# EAGLE design SpheroRemote_Version2 (EAGLE 9.0.1)
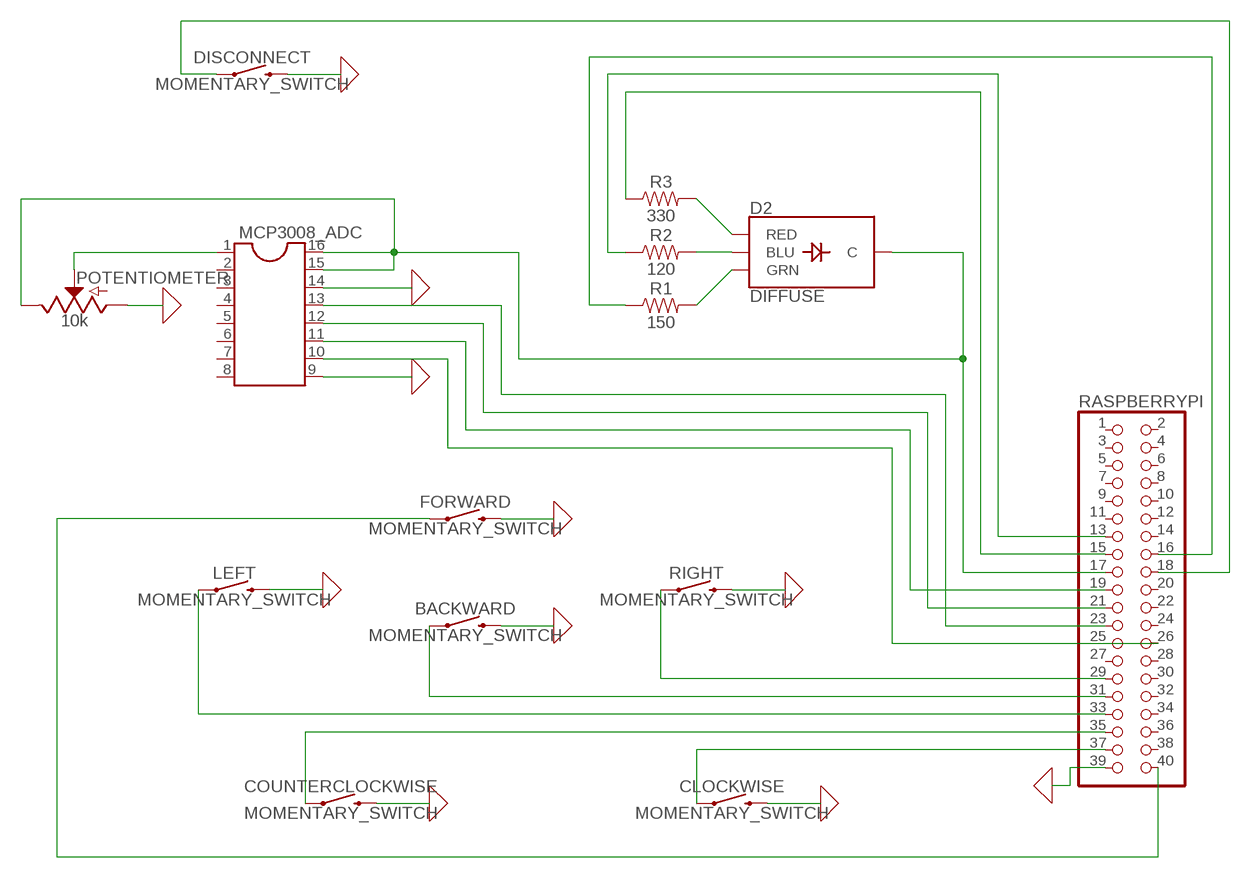
[diagram p0: schematic, sheet 1]

## Parts
BACKWARD  MOMENTARY_SWITCH  MOMENTARY-SWITCH-SPST-PTH-12MM  [TACTILE_SWITCH_PTH_12MM]
CLOCKWISE  MOMENTARY_SWITCH  MOMENTARY-SWITCH-SPST-PTH-12MM  [TACTILE_SWITCH_PTH_12MM]
COUNTERCLOCKWISE  MOMENTARY_SWITCH  MOMENTARY-SWITCH-SPST-PTH-12MM  [TACTILE_SWITCH_PTH_12MM]
D2  DIFFUSE  LED-RGB-CCDIFFUSE  [LED-RGB-THRU]
DISCONNECT  MOMENTARY_SWITCH  MOMENTARY-SWITCH-SPST-PTH-12MM  [TACTILE_SWITCH_PTH_12MM]
FORWARD  MOMENTARY_SWITCH  MOMENTARY-SWITCH-SPST-PTH-12MM  [TACTILE_SWITCH_PTH_12MM]
LEFT  MOMENTARY_SWITCH  MOMENTARY-SWITCH-SPST-PTH-12MM  [TACTILE_SWITCH_PTH_12MM]
MCP3008_ADC  DIL16  [DIL16]
POTENTIOMETER  10k  POTENTIOMETER-PTH-9MM-1/20W-20%-KIT  [POT-PTH-ALPS-KIT]
R1  150  330OHM-HORIZ-1/10W-5%  [AXIAL-0.3]
R2  120  330OHM-HORIZ-1/10W-5%  [AXIAL-0.3]
R3  330  330OHM-HORIZ-1/10W-5%  [AXIAL-0.3]
RASPBERRYPI  PINHD-2X20  [2X20]
RIGHT  MOMENTARY_SWITCH  MOMENTARY-SWITCH-SPST-PTH-12MM  [TACTILE_SWITCH_PTH_12MM]

## Nets
0: BACKWARD.3 CLOCKWISE.3 COUNTERCLOCKWISE.3 DISCONNECT.3 FORWARD.3 LEFT.3 MCP3008_ADC.9 MCP3008_ADC.14 POTENTIOMETER.P$3(A) RASPBERRYPI.39 RIGHT.3 ; supply symbol labelled GND
N$1: D2.3(GRN) R1.P$2
N$2: R3.P$1 RASPBERRYPI.15
N$3: D2.4(BLU) R2.P$2
N$4: MCP3008_ADC.1 POTENTIOMETER.P$2(S)
N$5: LEFT.1 RASPBERRYPI.33
N$6: BACKWARD.1 RASPBERRYPI.31
N$7: RASPBERRYPI.29 RIGHT.1
N$8: CLOCKWISE.1 RASPBERRYPI.37
N$9: COUNTERCLOCKWISE.1 RASPBERRYPI.35
N$10: D2.1(RED) R3.P$2
N$12: MCP3008_ADC.13 RASPBERRYPI.23
N$13: R2.P$1 RASPBERRYPI.13
N$14: MCP3008_ADC.12 RASPBERRYPI.21
N$15: MCP3008_ADC.11 RASPBERRYPI.19
N$16: D2.2(C) MCP3008_ADC.15 MCP3008_ADC.16 POTENTIOMETER.P$1(E) RASPBERRYPI.17
N$17: MCP3008_ADC.10 RASPBERRYPI.26
N$18: DISCONNECT.1 RASPBERRYPI.18
N$19: FORWARD.1 RASPBERRYPI.40
N$20: R1.P$1 RASPBERRYPI.16
Unconnected: MCP3008_ADC.2 MCP3008_ADC.3 MCP3008_ADC.4 MCP3008_ADC.5 MCP3008_ADC.6 MCP3008_ADC.7 MCP3008_ADC.8 RASPBERRYPI.1 RASPBERRYPI.2 RASPBERRYPI.3 RASPBERRYPI.4 RASPBERRYPI.5 RASPBERRYPI.6 RASPBERRYPI.7 RASPBERRYPI.8 RASPBERRYPI.9 RASPBERRYPI.10 RASPBERRYPI.11 RASPBERRYPI.12 RASPBERRYPI.14 RASPBERRYPI.20 RASPBERRYPI.22 RASPBERRYPI.24 RASPBERRYPI.25 RASPBERRYPI.27 RASPBERRYPI.28 RASPBERRYPI.30 RASPBERRYPI.32 RASPBERRYPI.34 RASPBERRYPI.36 RASPBERRYPI.38

## Library data of the parts
BACKWARD CLOCKWISE COUNTERCLOCKWISE DISCONNECT FORWARD LEFT RIGHT = SparkFun-Switches:MOMENTARY-SWITCH-SPST: Momentary Switch (Pushbutton) - SPST Normally-open (NO) SPST momentary switches (buttons, pushbuttons). Variants PTH-12MM - 12mm square, through-hole Momentary Pushbutton Switch - 12mm Square <https://www.sparkfun.com/products/9190> (COM-09190) PTH-6.0MM, PTH-6.0MM-KIT - 6.0mm square, through-hole Mini Pushbutton Switch <https://www.sparkfun.com/products/97> (COM-00097) KIT package intended for soldering kit's - only one side of pads' copper is exposed. PTH-RIGHT-ANGLE-KIT - Right-angle, through-hole Right Angle Tactile Button <https://www.sparkfun.com/products/10791> - Used on SparkFun BigTime Watch Kit <https://www.sparkfun.com/products/11734> SMD-12MM - 12mm square, surface-mount Tactile Button - SMD (12mm) <https://www.sparkfun.com/products/12993> (COM-12993) Used on SparkFun PicoBoard <https://www.sparkfun.com/products/11888> SMD-4.5MM - 4.5mm Square Trackball Switch Used on SparkFun Blackberry Trackballer Breakout <https://www.sparkfun.com/products/13169> SMD-4.6MMX2.8MM - 4.60mm x 2.80mm, surface mount Used on SparkFun SAMD21 Mini Breakout <https://www.sparkfun.com/products/13664> SMD-5.2MM, SMD-5.2-REDUNDANT - 5.2mm square, surface-mount Mini Pushbutton Switch - SMD <https://www.sparkfun.com/products/8720> (COM-08720) Used on Arduino Pro Mini <https://www.sparkfun.com/products/11114> REDUNDANT package connects both switch circuits together SMD-6.0X3.5MM - 6.0 x 3.5mm, surface mount Momentary Reset Switch SMD <https://www.sparkfun.com/products/8229> (COM-08229) SMD-6.2MM-TALL - 6.2mm square, surface mount Tactile Button - SMD (6mm) <https://www.sparkfun.com/products/12992> Used on SparkFun Digital Sandbox <https://www.sparkfun.com/products/12651> SMD-RIGHT-ANGLE - Right-angle, surface mount Used on SparkFun Block for Intel® Edison - Arduino <https://www.sparkfun.com/products/13036>; PROD_ID: SWCH-09185; SF_SKU: COM-09190
D2 = LED:LED-RGB-CC: LED-RGB Common Cathode Packages: LED RGB-THRU LED_PIRANHA_5MM SparkFun Products: RGB Diffused Common Cathode- Diffuse <[https://www.sparkfun.com/products/9264]> RGB Diffused Common Cathode - Clear <[https://www.sparkfun.com/products/105]> LED-RGB 5mm Square (Piranha) <[https://www.sparkfun.com/products/11679]>; PROD_ID: DIO-09434
MCP3008_ADC = ic-package:DIL16: Dual In Line / Socket; SPICEPREFIX: X
POTENTIOMETER = SparkFun-Resistors:POTENTIOMETER: Potentiometer (Pot) Three-terminal potentiometers, with an adjustable wiper and two adjustable resistors. A pot can be used to create a configurable voltage divider, or as a variable resistor. Variants ALPS_POT and ALPS_POT_KIT - PTH, breadboard compatible, 9mm square pots Rotary Potentiometer - Linear (10k ohm) <https://www.sparkfun.com/products/9288> (COM-09288) The KIT variant exposes copper on only one side of the PTH pad, so the part can only be assembled on one side of the PCB. Useful for beginner soldering kits.; PROD_ID: RES-09177; SF_SKU: COM-09288
R1 R2 = SparkFun-Resistors:330OHM: 330Ω resistor A resistor is a passive two-terminal electrical component that implements electrical resistance as a circuit element. Resistors act to reduce current flow, and, at the same time, act to lower voltage levels within circuits. - Wikipedia; PROD_ID: RES-8371; VALUE: 330
R3 = SparkFun-Resistors:330OHM: 330Ω resistor A resistor is a passive two-terminal electrical component that implements electrical resistance as a circuit element. Resistors act to reduce current flow, and, at the same time, act to lower voltage levels within circuits. - Wikipedia; PROD_ID: RES-8371
RASPBERRYPI = adafruit:PINHD-2X20: PIN HEADER

## Board
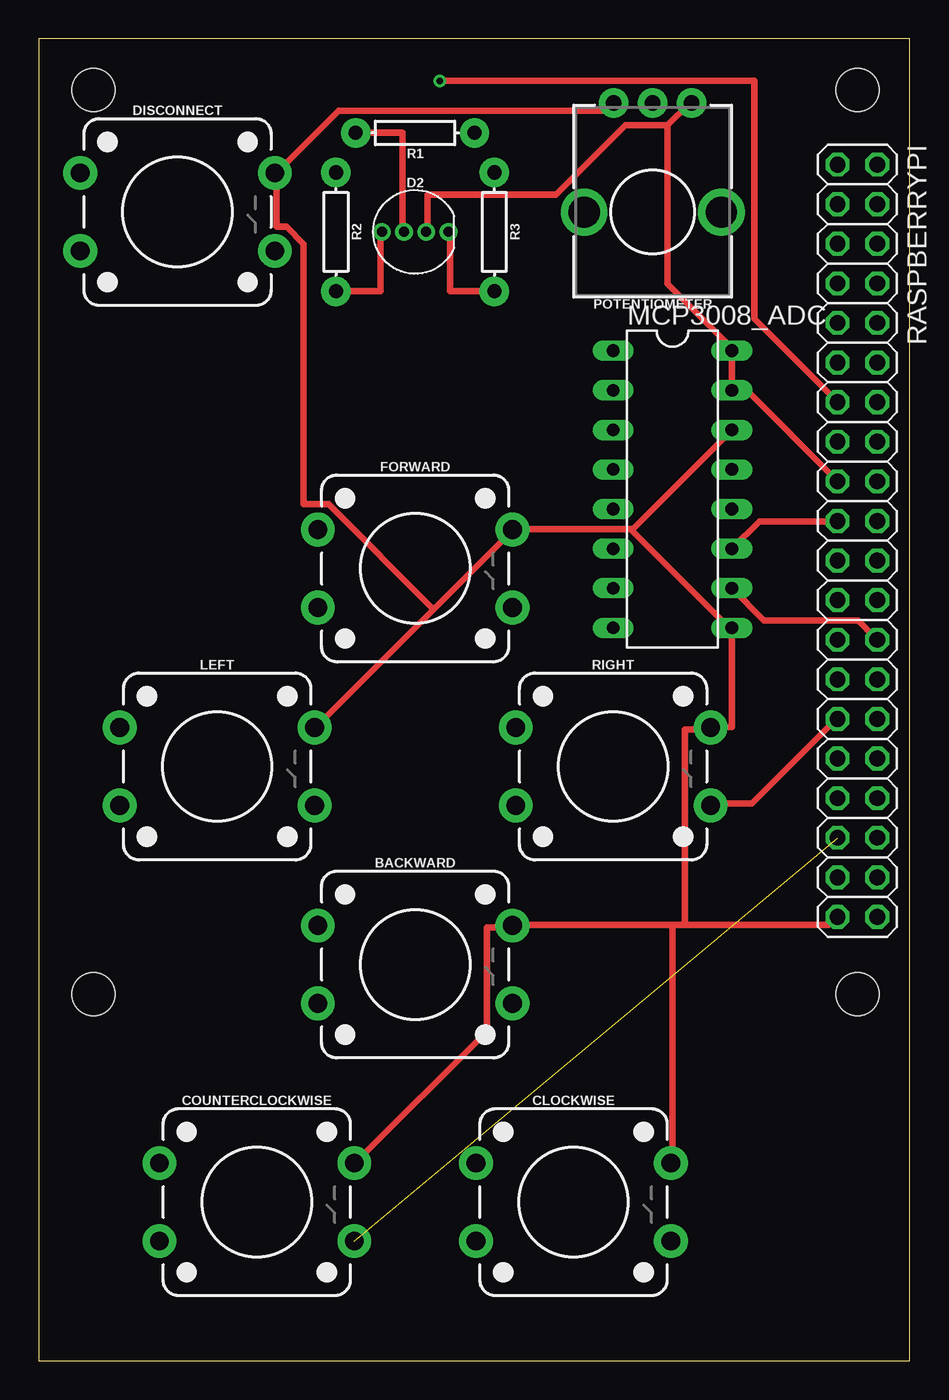
[diagram p1: board, top side]
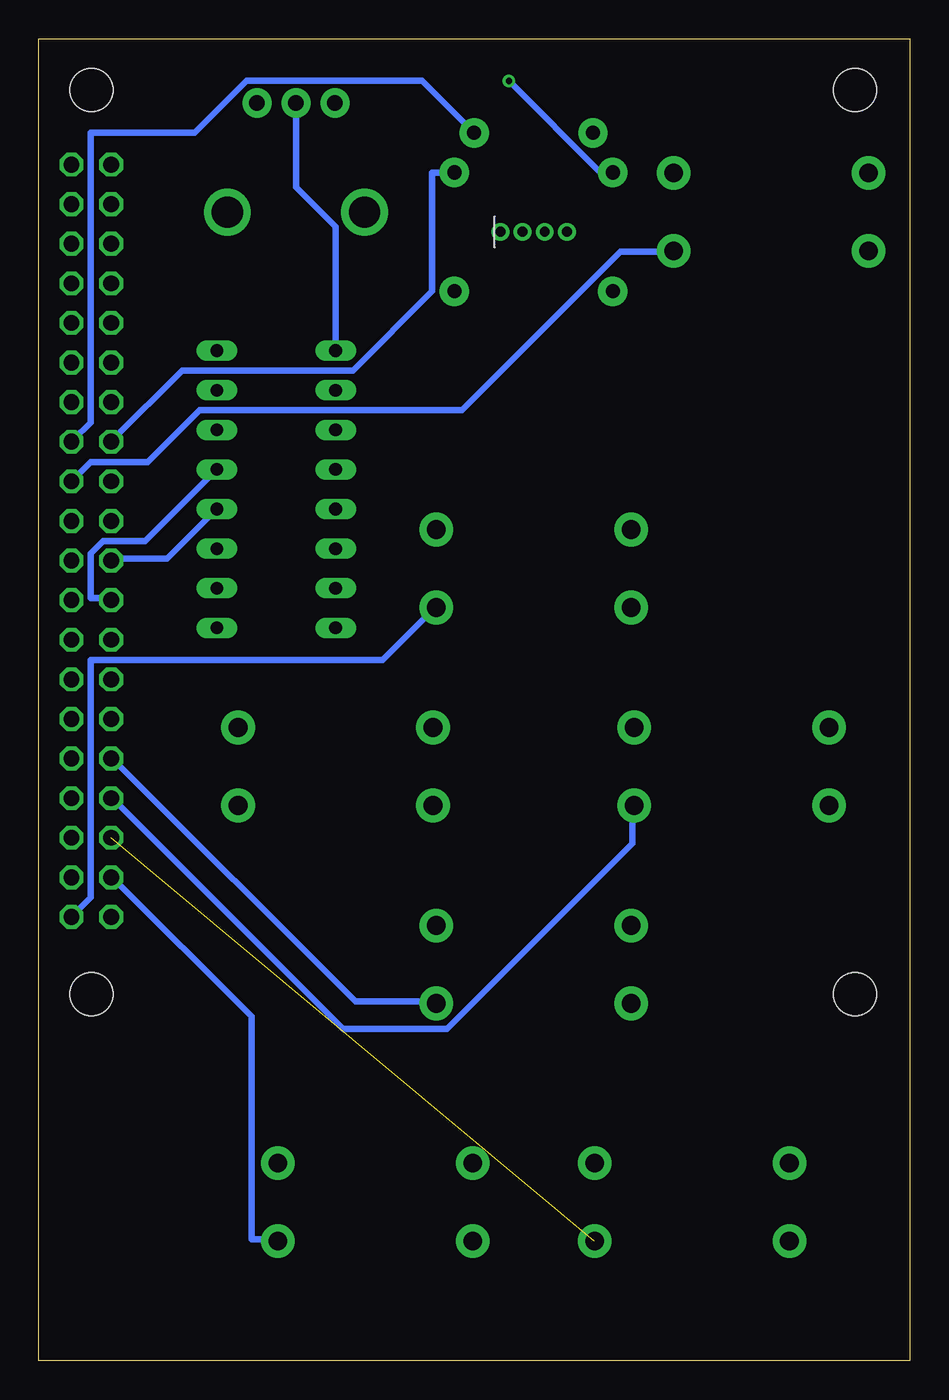
[diagram p2: board, bottom side, seen from below]

Size 55.86 x 84.76 mm. Coordinates in mm from the lower left corner, seen from the top.
Outline: 0,0 55.86,0 55.86,84.76 0,84.76 0,0
Copper layers (1*16): Top 0.035mm / dielectric 1.5mm / Bottom 0.035mm
Design rules "default *": minimum track width 16mil, minimum drill 0.4mm, track to track 12mil, track to pad 10mil, pad to pad 12mil, via to via 12mil, smd to smd 6mil, copper to edge 40mil, drill to drill 6mil, minimum pad ring 10mil, minimum via ring 8mil, stop-mask expansion 4mil, vias tented up to drill 0mil, thermal gap 10mil
Holes 2.74 mm at 52.5,81.48 3.51,81.48 3.51,23.5 52.5,23.5

### Footprints (pad centres in the part's own frame; a part is rotated, then mirrored left to right if it is on the bottom)
TACTILE_SWITCH_PTH_12MM = drill 1.2 pad 2.159: 1 6.25,-2.5; 2 -6.25,-2.5; 3 6.25,2.5; 4 -6.25,2.5
LED-RGB-THRU = drill 0.635 pad 0.711: 1 2.134,0; 2 0.711,0; 3 -0.711,0; 4 -2.134,0
DIL16 = drill 0.813 long: 1 -8.89,-3.81; 2 -6.35,-3.81; 3 -3.81,-3.81; 4 -1.27,-3.81; 5 1.27,-3.81; 6 3.81,-3.81; 7 6.35,-3.81; 8 8.89,-3.81; 9 8.89,3.81; 10 6.35,3.81; 11 3.81,3.81; 12 1.27,3.81; 13 -1.27,3.81; 14 -3.81,3.81; 15 -6.35,3.81; 16 -8.89,3.81
POT-PTH-ALPS-KIT = drill 1 pad 1.88: P$1 7,-2.5; P$2 7,0; P$3 7,2.5 | drill 2: P$4 0,-4.4; P$5 0,4.4
AXIAL-0.3 = drill 0.9 pad 1.88: P$1 -3.81,0; P$2 3.81,0
2X20 = drill 1.016 octagon: 1 -24.13,-1.27; 2 -24.13,1.27; 3 -21.59,-1.27; 4 -21.59,1.27; 5 -19.05,-1.27; 6 -19.05,1.27; 7 -16.51,-1.27; 8 -16.51,1.27; 9 -13.97,-1.27; 10 -13.97,1.27; 11 -11.43,-1.27; 12 -11.43,1.27; 13 -8.89,-1.27; 14 -8.89,1.27; 15 -6.35,-1.27; 16 -6.35,1.27; 17 -3.81,-1.27; 18 -3.81,1.27; 19 -1.27,-1.27; 20 -1.27,1.27; 21 1.27,-1.27; 22 1.27,1.27; 23 3.81,-1.27; 24 3.81,1.27; 25 6.35,-1.27; 26 6.35,1.27; 27 8.89,-1.27; 28 8.89,1.27; 29 11.43,-1.27; 30 11.43,1.27; 31 13.97,-1.27; 32 13.97,1.27; 33 16.51,-1.27; 34 16.51,1.27; 35 19.05,-1.27; 36 19.05,1.27; 37 21.59,-1.27; 38 21.59,1.27; 39 24.13,-1.27; 40 24.13,1.27

### Placement (x,y rotation side)
BACKWARD  24.13,25.4 0 top
CLOCKWISE  34.29,10.16 0 top
COUNTERCLOCKWISE  13.97,10.16 0 top
D2  24.13,72.39 0 top
DISCONNECT  8.89,73.66 0 top
FORWARD  24.13,50.8 0 top
LEFT  11.43,38.1 0 top
MCP3008_ADC  40.64,55.88 270 top
POTENTIOMETER  39.37,73.66 90 top
R1  24.13,78.74 180 top
R2  19.05,72.39 270 top
R3  29.21,72.39 270 top
RASPBERRYPI  52.5,52.58 270 top
RIGHT  36.83,38.1 0 top

### Tracks (layer width: path | path; a pad name or v marks a point on that pad's centre or on a via)
0
  Top 0.406: 40.64,27.94 30.48,27.94 BACKWARD.3 30.32,27.78 28.73,27.78 28.73,21.11 20.32,12.7 COUNTERCLOCKWISE.3 | 40.64,27.94 41.43,27.94 | 41.43,27.94 50.64,27.94 51.12,28.42 RASPBERRYPI.39 | 40.64,27.94 40.64,12.7 CLOCKWISE.3 | POTENTIOMETER.P$3 36.83,80.64 36.35,80.17 19.21,80.17 15.24,76.2 DISCONNECT.3 15.24,76.04 15.24,72.71 15.88,72.71 16.99,71.6 16.99,54.93 18.57,54.93 25.32,48.18 | 38.1,53.34 MCP3008_ADC.14 | 38.1,53.34 30.48,53.34 FORWARD.3 30.32,53.18 25.32,48.18 | 25.32,48.18 17.78,40.64 LEFT.3 | 38.1,53.34 38.1,53.18 44.29,46.99 MCP3008_ADC.9 44.45,40.64 43.18,40.64 RIGHT.3 43.02,40.48 41.43,40.48 41.43,27.94
N$1
  Top 0.406: R1.P$2 23.34,78.74 23.34,72.39 D2.3
N$2
  Bottom 0.406: R3.P$1 30.64,76.2 30.64,68.58 35.72,63.5 46.67,63.5 51.12,59.05 RASPBERRYPI.15
N$3
  Top 0.406: R2.P$2 21.91,68.58 21.91,72.39 D2.4
N$4
  Bottom 0.406: MCP3008_ADC.1 36.83,72.71 39.37,75.25 POTENTIOMETER.P$2
N$5
  Bottom 0.406: RASPBERRYPI.33 51.12,36.04 36.35,21.27 29.69,21.27 17.78,33.18 17.78,35.56 LEFT.1
N$6
  Bottom 0.406: RASPBERRYPI.31 51.12,38.58 35.56,23.02 30.48,23.02 BACKWARD.1
N$7
  Top 0.406: RASPBERRYPI.29 51.12,41.12 45.72,35.72 43.18,35.72 RIGHT.1
N$8
  Bottom 0.406: RASPBERRYPI.37 51.12,30.96 42.23,22.07 42.23,7.78 40.64,7.78 CLOCKWISE.1
N$9  (1 unrouted)
N$10
  Top 0.406: R3.P$2 26.35,68.58 26.35,72.39 D2.1
N$12
  Bottom 0.406: MCP3008_ADC.13 49.05,52.55 51.75,52.55 52.55,51.75 52.55,48.9 51.28,48.9 RASPBERRYPI.23
N$13  (via drill 0.4)
  Top 0.406: v25.72,82.07 45.88,82.07 45.88,66.83 51.12,61.59 RASPBERRYPI.13
  Bottom 0.406: v25.72,82.07 19.84,76.2 R2.P$1
N$14
  Bottom 0.406: MCP3008_ADC.12 47.62,51.44 51.12,51.44 RASPBERRYPI.21
N$15
  Top 0.406: MCP3008_ADC.11 46.2,53.82 51.12,53.82 RASPBERRYPI.19
N$16
  Top 0.406: RASPBERRYPI.17 51.12,56.52 45.4,62.23 MCP3008_ADC.15 MCP3008_ADC.16 44.45,64.93 40.32,69.06 40.32,79.22 | 40.32,79.22 37.62,79.22 33.18,74.77 24.92,74.77 24.92,72.39 D2.2 | 40.32,79.22 41.75,80.64 POTENTIOMETER.P$1
N$17
  Top 0.406: MCP3008_ADC.10 46.51,47.47 52.55,47.47 53.66,46.35 RASPBERRYPI.26
N$18
  Bottom 0.406: RASPBERRYPI.18 53.66,56.52 52.55,57.63 48.9,57.63 45.56,60.96 28.73,60.96 18.57,71.12 15.24,71.12 DISCONNECT.1
N$19
  Bottom 0.406: RASPBERRYPI.40 53.66,28.57 52.55,29.69 52.55,44.93 33.81,44.93 30.48,48.26 FORWARD.1
N$20
  Bottom 0.406: R1.P$1 31.27,82.07 42.55,82.07 45.88,78.74 52.55,78.74 52.55,60.17 53.66,59.05 RASPBERRYPI.16